# Altium schematic sheet SD Card.schDoc: SD Card Wiring
size A; Date: 3/13/2021; Author: Jesse Fernandez; CompanyName: GVSU; DrawnBy: Jesse Fernandez; Organization: Kennedy Hall of Engineering; Address1: 301 Fulton St. W; Address2: Grand Rapids, MI 49504; DocumentNumber: 1; Revision: 0.1; SheetNumber: 7; SheetTotal: 7; Time: 5:42 am
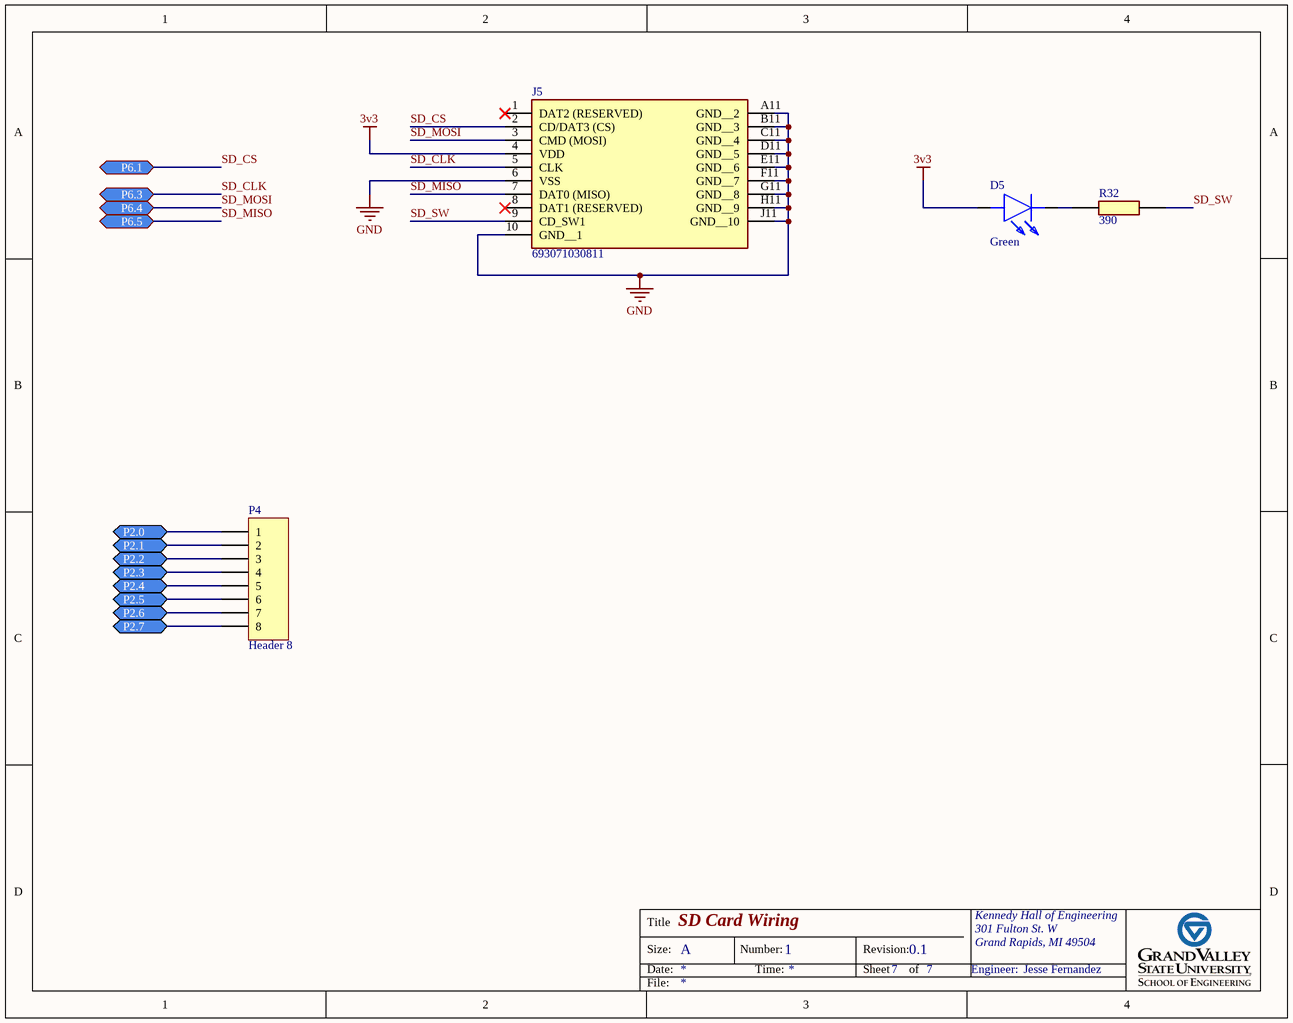
[diagram p0: SD Card.schDoc]

## Parts
D5  Color: Green  [SML-LX0201UPGC-TR]  (hidden comment: SML-LX0201UPGC-TR)
J5  693071030811  [693071030811]
P4  Header 8  [HDR1X8]
R32  value 390  [Thin-Film Resistor 0402 (1005 Metric)]  (hidden comment: Resistor 0402 (1005 Metric))

## Ports
P2.0 (bidir), P2.1 (bidir), P2.2 (bidir), P2.3 (bidir), P2.4 (bidir), P2.5 (bidir), P2.6 (bidir), P2.7 (bidir), P6.1 (bidir), P6.3 (bidir), P6.4 (bidir), P6.5 (bidir)

## Nets
3v3: D5.2(A) J5.4(VDD)
GND: J5.6(VSS) J5.10(GND__1) J5.A11(GND__2) J5.B11(GND__3) J5.C11(GND__4) J5.D11(GND__5) J5.E11(GND__6) J5.F11(GND__7) J5.G11(GND__8) J5.H11(GND__9) J5.J11(GND__10)
P2.0: P4.1 ; port P2.0
P2.1: P4.2 ; port P2.1
P2.2: P4.3 ; port P2.2
P2.3: P4.4 ; port P2.3
P2.4: P4.5 ; port P2.4
P2.5: P4.6 ; port P2.5
P2.6: P4.7 ; port P2.6
P2.7: P4.8 ; port P2.7
SD_CLK: J5.5(CLK) ; port P6.3
SD_CS: J5.2(CD/DAT3_(CS)) ; port P6.1
SD_MISO: J5.7(DAT0_(MISO)) ; port P6.5
SD_MOSI: J5.3(CMD_(MOSI)) ; port P6.4
SD_SW: J5.9(CD_SW1) R32.2
NetD5_1: D5.1(K) R32.1

Not connected (* = marked no-connect by the designer): J5 1(DAT2_(RESERVED))* 8(DAT1_(RESERVED))*

## Notes on the sheet
- Title
- Size:
- Date:
- A
- Number:
- Time:
- Revision:
- Sheet
- of
- Engineer:
- File:

## Library data of the parts
D5 = SML-LX0201UPGC-TR: Standard LEDs - SMD 0201 SMD LEDs 520nm Green; Manufacturer: Lumex; Vendor: Mouser; Vendor P/N: 696-SMLLX0201UPGCTR; V_forward: 2.7 [V]; I_forward: 2 [mA]; Manufacturer P/N: SML-LX0201UPGC-TR; Price: $0.47; ComponentLink1Description: Datasheet; ComponentLink1URL: https://www.mouser.com/datasheet/2/244/Lumex_07252017_SML-LX0201UPGC-TR%20(S-0)-1176641.pdf
J5 = 693071030811: Memory Card Connectors WR-CRD_SMT_MicroSD_Push & Push - SW closes to ground; Manufacturer: Würth Elektronik; Vendor: Mouser; Vendor P/N: 710-693071030811; Manufacturer P/N: 693071030811; Price: $3.76; ComponentLink1Description: Datasheet; ComponentLink1URL: https://www.we-online.com/catalog/datasheet/693071030811.pdf; ComponentLink2Description: SD Card SPI Comms; ComponentLink2URL: https://components101.com/asset/sites/default/files/component_datasheet/Micro%20SD%20Card%20Datasheet.pdf
P4 = Header 8: Header, 8-Pin; LatestRevisionDate: 17-Jul-2002; LatestRevisionNote: Re-released for DXP Platform.; Publisher: Altium Limited
R32 = Resistor 0402 (1005 Metric): Resistor, 0402 Package size; Manufacturer: Yageo; Manfacturer P/N: RC0402FR-07390RL; Vendor: Mouser; Vendor P/N: 603-RC0402FR-07390RL; Tolerance: 1%; Price: $0.10; ComponentLink1Description: Datasheet; ComponentLink1URL: *